# Altium schematic sheet Optional-Connectors.SchDoc
size A; SheetNumber: 10; SheetTotal: 10
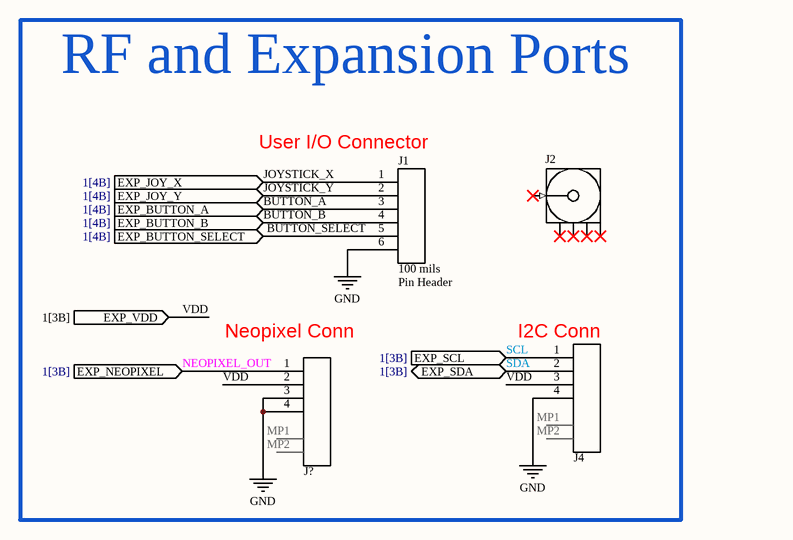
[diagram p0: Optional-Connectors.SchDoc]

## Parts
J1  Pitch: 100 mils  Part Number: Pin Header  [PCB-CONN-PIN-HEADER-6-PIN-100-MIL]  (hidden comment: CONN-PIN-HEADER-6-PINS-100-MIL)
J2  CONN-RF-SMA-THRU-RA  [PCB-CON-SMA-RA-NO-FEED]  (value not drawn)
J4  CONN-JST-4PIN-2MM-S4B-PH-SM4-TB(LF)(SN)  [PCB-CONN-JST- S4B-PH-SM4-TB(LF)(SN)3]  (value not drawn)
J?  CONN-JST-4PIN-2MM-S4B-PH-SM4-TB(LF)(SN)  [PCB-CONN-JST- S4B-PH-SM4-TB(LF)(SN)3]  (value not drawn)

## Ports
EXP_BUTTON_A (in, see 1[4B]), EXP_BUTTON_B (in, see 1[4B]), EXP_BUTTON_SELECT (in, see 1[4B]), EXP_JOY_X (in, see 1[4B]), EXP_JOY_Y (in, see 1[4B]), EXP_NEOPIXEL (in, see 1[3B]), EXP_SCL (in, see 1[3B]), EXP_SDA (bidir, see 1[3B]), EXP_VDD (in, see 1[3B])

## Nets
GND: J1.6 J4.4 J?.3 J?.4
BUTTON_A: J1.3 ; port EXP_BUTTON_A
BUTTON_B: J1.4 ; port EXP_BUTTON_B
BUTTON_SELECT: J1.5 ; port EXP_BUTTON_SELECT
JOYSTICK_X: J1.1 ; port EXP_JOY_X
JOYSTICK_Y: J1.2 ; port EXP_JOY_Y
NEOPIXEL_OUT: J?.1 ; port EXP_NEOPIXEL
SCL: J4.1 ; port EXP_SCL
SDA: J4.2 ; port EXP_SDA
VDD: J4.3 J?.2 ; port EXP_VDD

Not connected (* = marked no-connect by the designer): J2 1(Signal)* 2(GND)* 3(GND)* 4(GND)* 5(GND)*; J4 MP1 MP2; J? MP1 MP2

## Notes on the sheet
- RF and Expansion Ports
- (near J1) User I/O Connector
- (near J?) Neopixel Conn
- (near J4) I2C Conn

## Library data of the parts
J1 = CMP-00051-2: PinHeader 1x6 TH Pitch 2.54mm
J2 = CMP-00094-2: RP-SMA Connector Right Angle Jack (Female), PCB Through-Hole Mount, Nickel; Polarity: Reverse; Center Contact Plating: Gold; Impedance: 50R; Clock Frequency: 12.4GHz; Dielectric Material: PTFE; Body Material: Brass; Number of Ports: 1; Mating Cycles: 500; Connector Type: SMA,Receptacle,Male Pin; Lead Free: Lead Free; Package Quantity: 100; Contact Plating: Gold; Termination: Solder; Mounting Technology: Through Hole; Length: 15.1mm; Plating: Nickel; Case/Package: SMA; Min Operating Temperature: -65°C; Body Plating: Nickel; RoHS Compliant: Yes; Housing Color: Silver; Orientation: Right Angle; Packaging: Tray; Max Operating Temperature: 165°C; Series: -; Fastening Type: Threaded; Contact Material: Copper
J4 J? = CMP-00095-1: Connector Header, PH Series, 4 Position, Side Entry, 2.00mm, Solder, Surface Mount, Natural.; Number of Positions: 4; Insulation Resistance: 1GR; Max Current Rating: 2A; Contact Resistance: 20mR; Voltage Rating (AC): 100V; Gender: Male; Pitch: 2mm; Fastening Type: Detent; Orientation: Right Angle; Lead Free: Lead Free; Housing Material: Polyamide; Packaging: Tape and Reel; Housing Color: Beige; Max Operating Temperature: 85°C; Insulation Material: Nylon; Number of Rows: 1; Number of Poles: 4; Contact Finish - Mating: TIN; Number of Contacts: 4; Reach SVHC Compliant: No; Height: 9.4mm; Series: PH; Max Voltage Rating (DC): 100V; Termination: Solder; Max Voltage Rating (AC): 100V; Contact Plating: Tin,Copper; Insulation Color: Natural; Color: White; Contact Material: Copper Alloy,Tin,Bronze,Brass; Flammability Rating: UL94 V-0; Mounting Technology: Surface Mount; Contact Type: Male Pin; Lead Pitch: 2mm; Working Voltage: 100V; Depth: 7.6mm; Connector Type: Header; Length: 11.9mm; Min Operating Temperature: -25°C; Current Rating: 2A; Voltage Rating: 100V; Width: 5mm; Contact Shape: Square